# EAGLE schematic untitled (EAGLE 8.1.0)

## Sheet 1 of 2
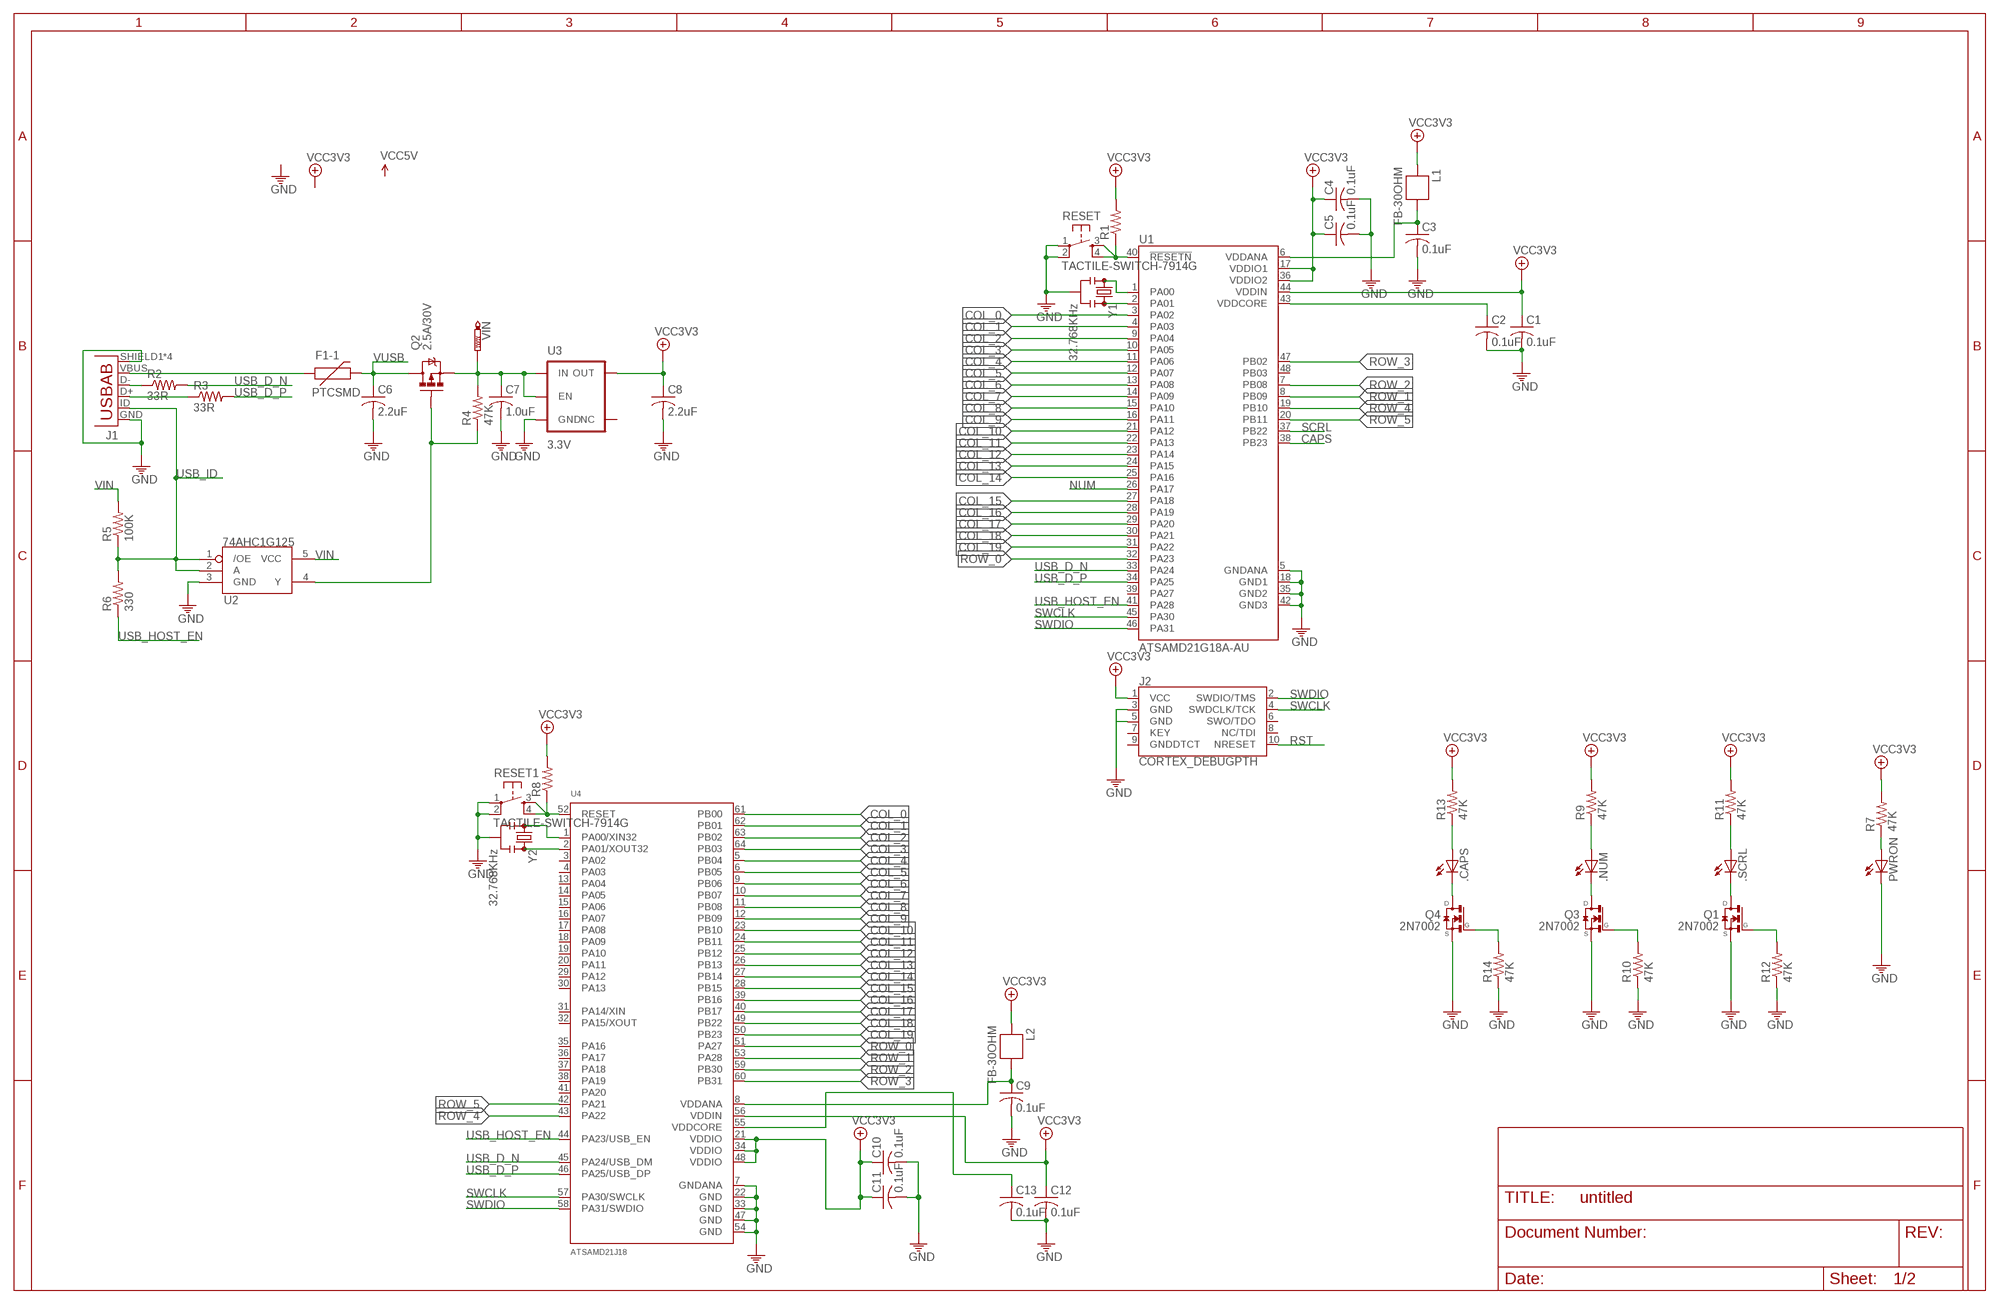
[diagram p0: schematic, sheet 1]

### Parts
.CAPS  LEDCHIPLED_1206  [CHIPLED_1206]
.NUM  LEDCHIPLED_1206  [CHIPLED_1206]
.SCRL  LEDCHIPLED_1206  [CHIPLED_1206]
C1  0.1uF  C-USC0603  [C0603]
C2  0.1uF  C-USC0603  [C0603]
C3  0.1uF  C-USC0603  [C0603]
C4  0.1uF  C-USC0603  [C0603]
C5  0.1uF  C-USC0603  [C0603]
C6  2.2uF  C-USC0603  [C0603]
C7  1.0uF  C-USC0603  [C0603]
C8  2.2uF  C-USC0603  [C0603]
C9  0.1uF  C-USC0603  [C0603]
C10  0.1uF  C-USC0603  [C0603]
C11  0.1uF  C-USC0603  [C0603]
C12  0.1uF  C-USC0603  [C0603]
C13  0.1uF  C-USC0603  [C0603]
F1-1  PTCSMD  [PTC-1206]
J1  USB-AB"  [USB_AB_MICRO_1:1_V2]
J2  CORTEX_DEBUGPTH  [2X5-PTH-1.27MM]
L1  FB-30OHM  FB  [0603]
L2  FB-30OHM  FB  [0603]
PWRON  LEDCHIPLED_1206  [CHIPLED_1206]
Q1  2N7002  [SOT23]
Q2  2.5A/30V  MOSFET-PCHANNELDMG2307L  [SOT23-3]
Q3  2N7002  [SOT23]
Q4  2N7002  [SOT23]
R1  R-US_R0603  [R0603]
R2  33R  R-US_R0603  [R0603]
R3  33R  R-US_R0603  [R0603]
R4  47K  R-US_R0603  [R0603]
R5  100K  R-US_R0603  [R0603]
R6  330  R-US_R0603  [R0603]
R7  47K  R-US_R0603  [R0603]
R8  R-US_R0603  [R0603]
R9  47K  R-US_R0603  [R0603]
R10  47K  R-US_R0603  [R0603]
R11  47K  R-US_R0603  [R0603]
R12  47K  R-US_R0603  [R0603]
R13  47K  R-US_R0603  [R0603]
R14  47K  R-US_R0603  [R0603]
RESET  TACTILE-SWITCH-7914G  [7914G]
RESET1  TACTILE-SWITCH-7914G  [7914G]
U1  ATSAMD21G18A-AU  [QFP50P900X900X120-48N]
U2  74AHC1G125  [SOT23-5]
U3  3.3V  V_REG_AP2112K-3.3V  [SOT23-5]
U4  ATSAMD21J18  [ATSAMD21J18]
VIN  PTR1PAD1-17  [P1-17]
Y1  32.768KHz  RESONATOR16MHZ  [RESONATOR-SMD]
Y2  32.768KHz  RESONATOR16MHZ  [RESONATOR-SMD]

### Nets
CAPS: Q4.1(G) R14.2 U1.38(PB23)
COL_0: U1.3(PA02) U4.61(PB00) ; also sheet 2
COL_1: U1.4(PA03) U4.62(PB01) ; also sheet 2
COL_2: U1.9(PA04) U4.63(PB02) ; also sheet 2
COL_3: U1.10(PA05) U4.64(PB03) ; also sheet 2
COL_4: U1.11(PA06) U4.5(PB04) ; also sheet 2
COL_5: U1.12(PA07) U4.6(PB05) ; also sheet 2
COL_6: U1.13(PA08) U4.9(PB06) ; also sheet 2
COL_7: U1.14(PA09) U4.10(PB07) ; also sheet 2
COL_8: U1.15(PA10) U4.11(PB08) ; also sheet 2
COL_9: U1.16(PA11) U4.12(PB09) ; also sheet 2
COL_10: U1.21(PA12) U4.23(PB10) ; also sheet 2
COL_11: U1.22(PA13) U4.24(PB11) ; also sheet 2
COL_12: U1.23(PA14) U4.25(PB12) ; also sheet 2
COL_13: U1.24(PA15) U4.26(PB13) ; also sheet 2
COL_14: U1.25(PA16) U4.27(PB14) ; also sheet 2
COL_15: U1.27(PA18) U4.28(PB15) ; also sheet 2
COL_16: U1.28(PA19) U4.39(PB16) ; also sheet 2
COL_17: U1.29(PA20) U4.40(PB17) ; also sheet 2
COL_18: U1.30(PA21) U4.49(PB22) ; also sheet 2
COL_19: U1.31(PA22) U4.50(PB23) ; also sheet 2
D_N: J1.D- R2.1
D_P: J1.D+ R3.1
GND: C1.2 C2.2 C3.2 C4.2 C5.2 C6.2 C7.2 C8.2 C9.2 C10.2 C11.2 C12.2 C13.2 J1.GND J1.SHIELD1(SHIELD) J1.SHIELD2(SHIELD) J1.SHIELD3(SHIELD) J1.SHIELD4(SHIELD) J2.3(GND) J2.5(GND) PWRON.C Q1.2(S) Q3.2(S) Q4.2(S) R10.1 R12.1 R14.1 RESET1.1 RESET1.2 RESET.1 RESET.2 U1.5(GNDANA) U1.18(GND1) U1.35(GND2) U1.42(GND3) U2.3(GND) U3.2(GND) U4.7(GNDANA) U4.22(GND) U4.33(GND) U4.47(GND) U4.54(GND) Y1.2 Y2.2
N$1: U1.1(PA00) Y1.1
N$2: C2.1 U1.43(VDDCORE)
N$3: U1.2(PA01) Y1.3
N$4: C3.1 L1.1 U1.6(VDDANA)
N$6: Q2.1(G) R4.1 U2.4(Y)
N$8: F1-1.1 J1.VBUS
N$9: PWRON.A R7.1
N$10: .SCRL.A R11.1
N$11: .NUM.A R9.1
N$12: .NUM.C Q3.3(D)
N$15: .SCRL.C Q1.3(D)
N$20: U4.1(PA00/XIN32) Y2.1
N$21: U4.2(PA01/XOUT32) Y2.3
N$22: C9.1 L2.1 U4.8(VDDANA)
N$23: C13.1 U4.55(VDDCORE)
N$24: .CAPS.A R13.1
N$25: .CAPS.C Q4.3(D)
NUM: Q3.1(G) R10.2 U1.26(PA17)
ROW_0: U1.32(PA23) U4.51(PA27) ; also sheet 2
ROW_1: U1.8(PB09) U4.53(PA28) ; also sheet 2
ROW_2: U1.7(PB08) U4.59(PB30) ; also sheet 2
ROW_3: U1.47(PB02) U4.60(PB31) ; also sheet 2
ROW_4: U1.19(PB10) U4.43(PA22) ; also sheet 2
ROW_5: U1.20(PB11) U4.42(PA21) ; also sheet 2
RST: J2.10(NRESET) R1.1 RESET.3 RESET.4 U1.40(!RESETN)
RST1: R8.1 RESET1.3 RESET1.4 U4.52(RESET)
SCRL: Q1.1(G) R12.2 U1.37(PB22)
SWCLK: J2.4(SWDCLK/TCK) U1.45(PA30) U4.57(PA30/SWCLK)
SWDIO: J2.2(SWDIO/TMS) U1.46(PA31) U4.58(PA31/SWDIO)
USB_D_N: R2.2 U1.33(PA24) U4.45(PA24/USB_DM)
USB_D_P: R3.2 U1.34(PA25) U4.46(PA25/USB_DP)
USB_HOST_EN: R6.1 U1.41(PA28)
USB_ID: J1.ID(USBID) R5.1 R6.2 U2.1(/OE) U2.2(A)
VCC3V3: C1.1 C4.1 C5.1 C8.1 C10.1 C11.1 C12.1 J2.1(VCC) L1.2 L2.2 R1.2 R7.2 R8.2 R9.2 R11.2 R13.2 U1.17(VDDIO1) U1.36(VDDIO2) U1.44(VDDIN) U3.5(OUT) U4.21(VDDIO) U4.34(VDDIO) U4.48(VDDIO) U4.56(VDDIN)
VIN: C7.1 Q2.2(S) R4.2 R5.2 U2.5(VCC) U3.1(IN) U3.3(EN) VIN.TP
VUSB: C6.1 F1-1.2 Q2.3(D)
Unconnected: J2.6(SWO/TDO) J2.7(KEY) J2.8(NC/TDI) J2.9(GNDDTCT) U1.39(PA27) U1.48(PB03) U3.4(NC) U4.3(PA02) U4.4(PA03) U4.13(PA04) U4.14(PA05) U4.15(PA06) U4.16(PA07) U4.17(PA08) U4.18(PA09) U4.19(PA10) U4.20(PA11) U4.29(PA12) U4.30(PA13) U4.31(PA14/XIN) U4.32(PA15/XOUT) U4.35(PA16) U4.36(PA17) U4.37(PA18) U4.38(PA19) U4.41(PA20) U4.44(PA23/USB_EN)

## Sheet 2 of 2
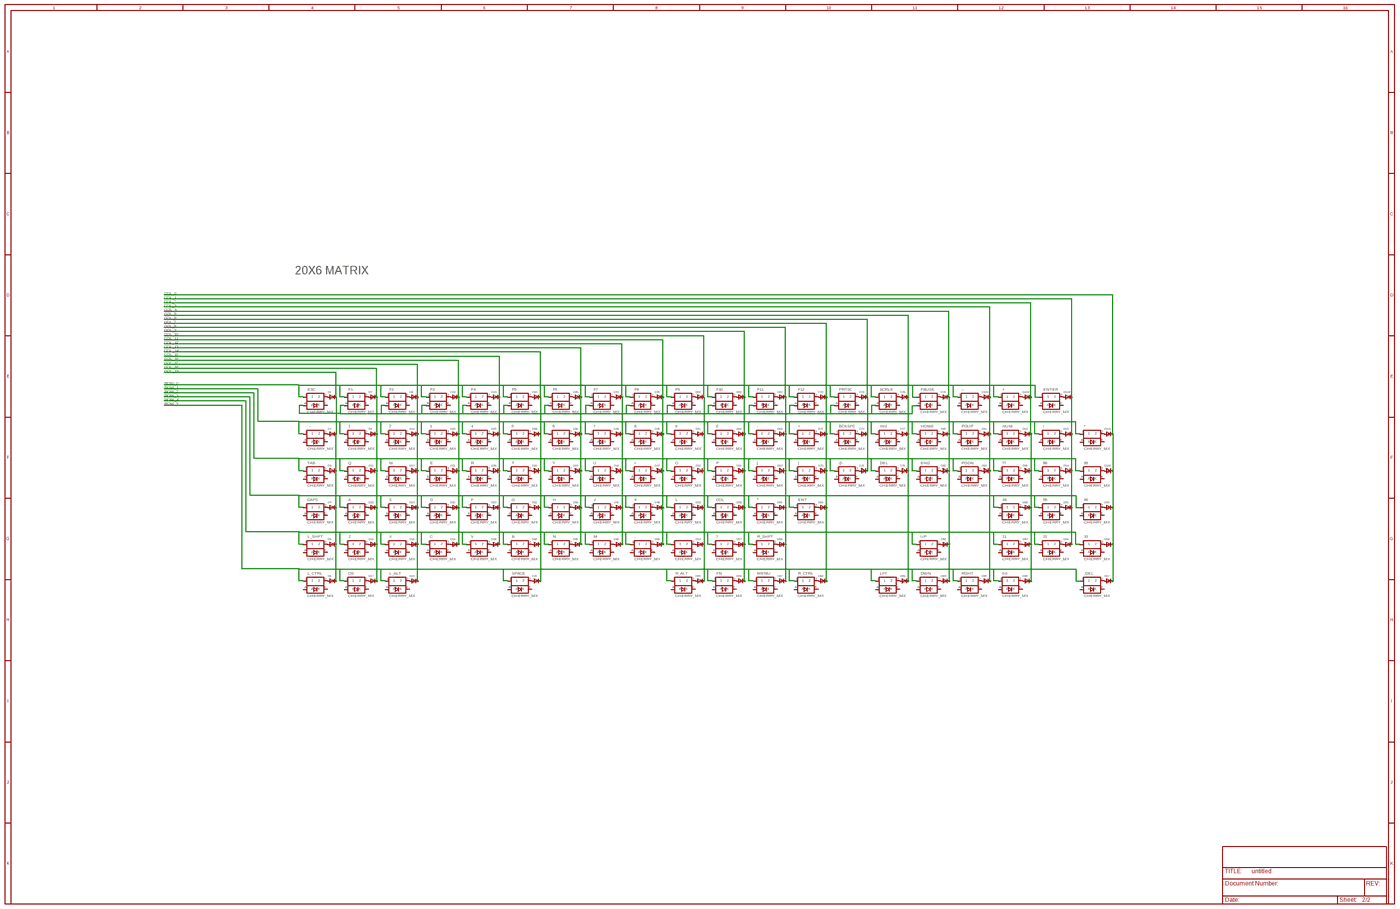
[diagram p1: schematic, sheet 2, overview]
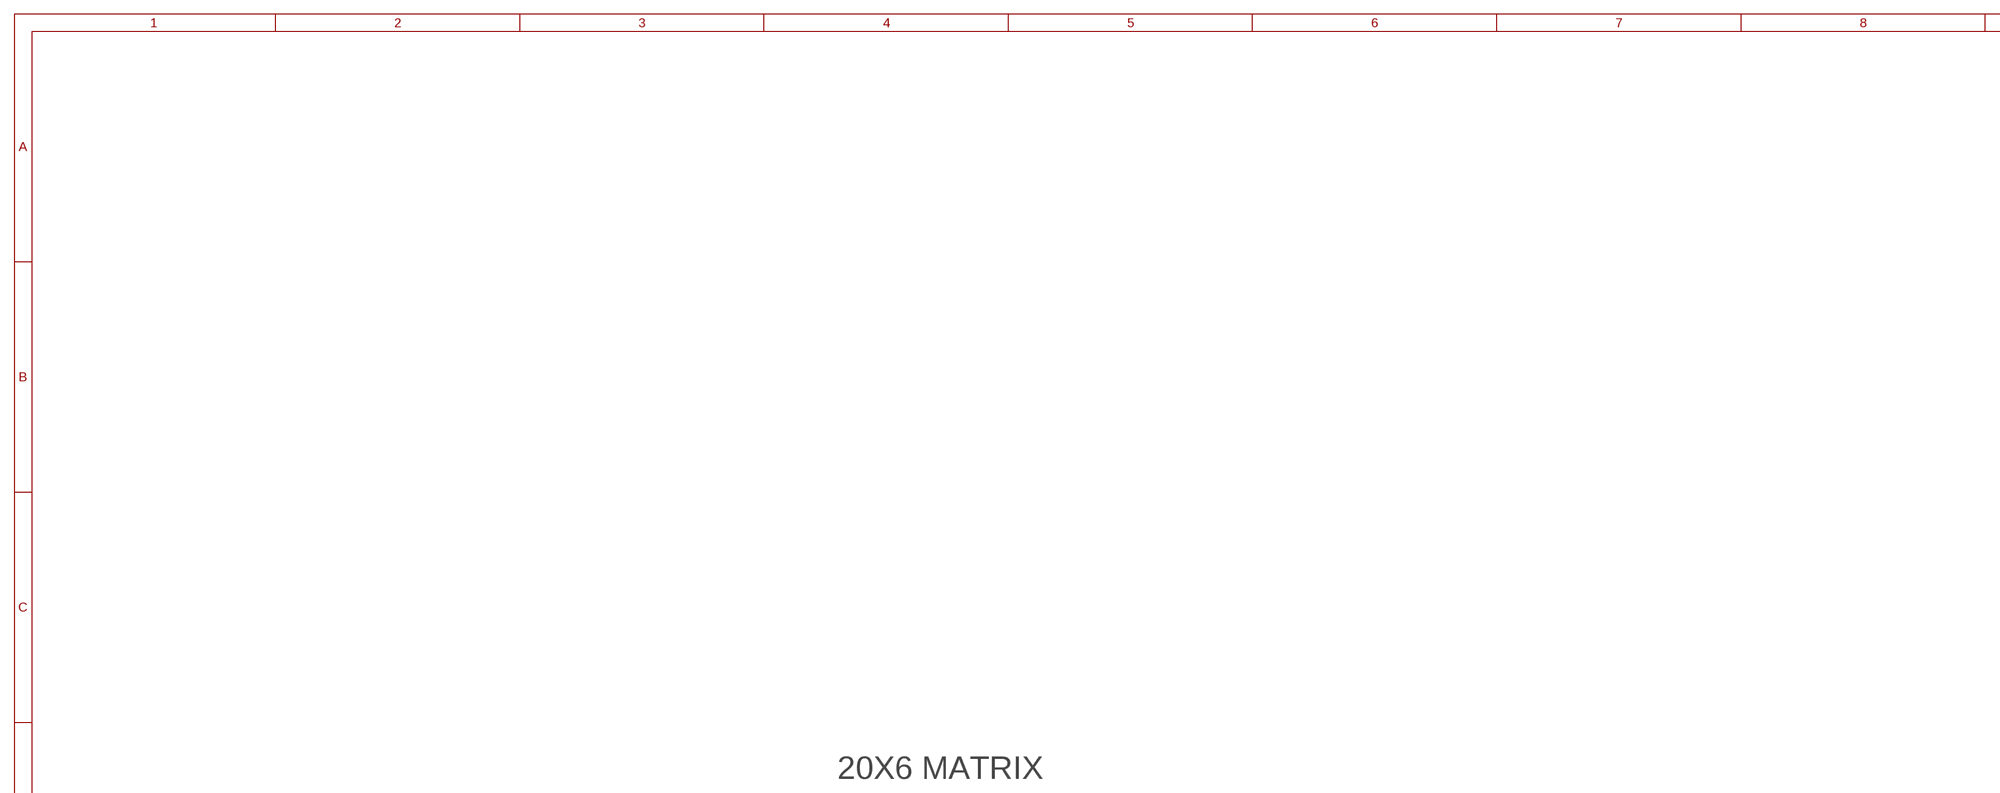
[diagram p2: schematic, sheet 2, part 1 of 4]
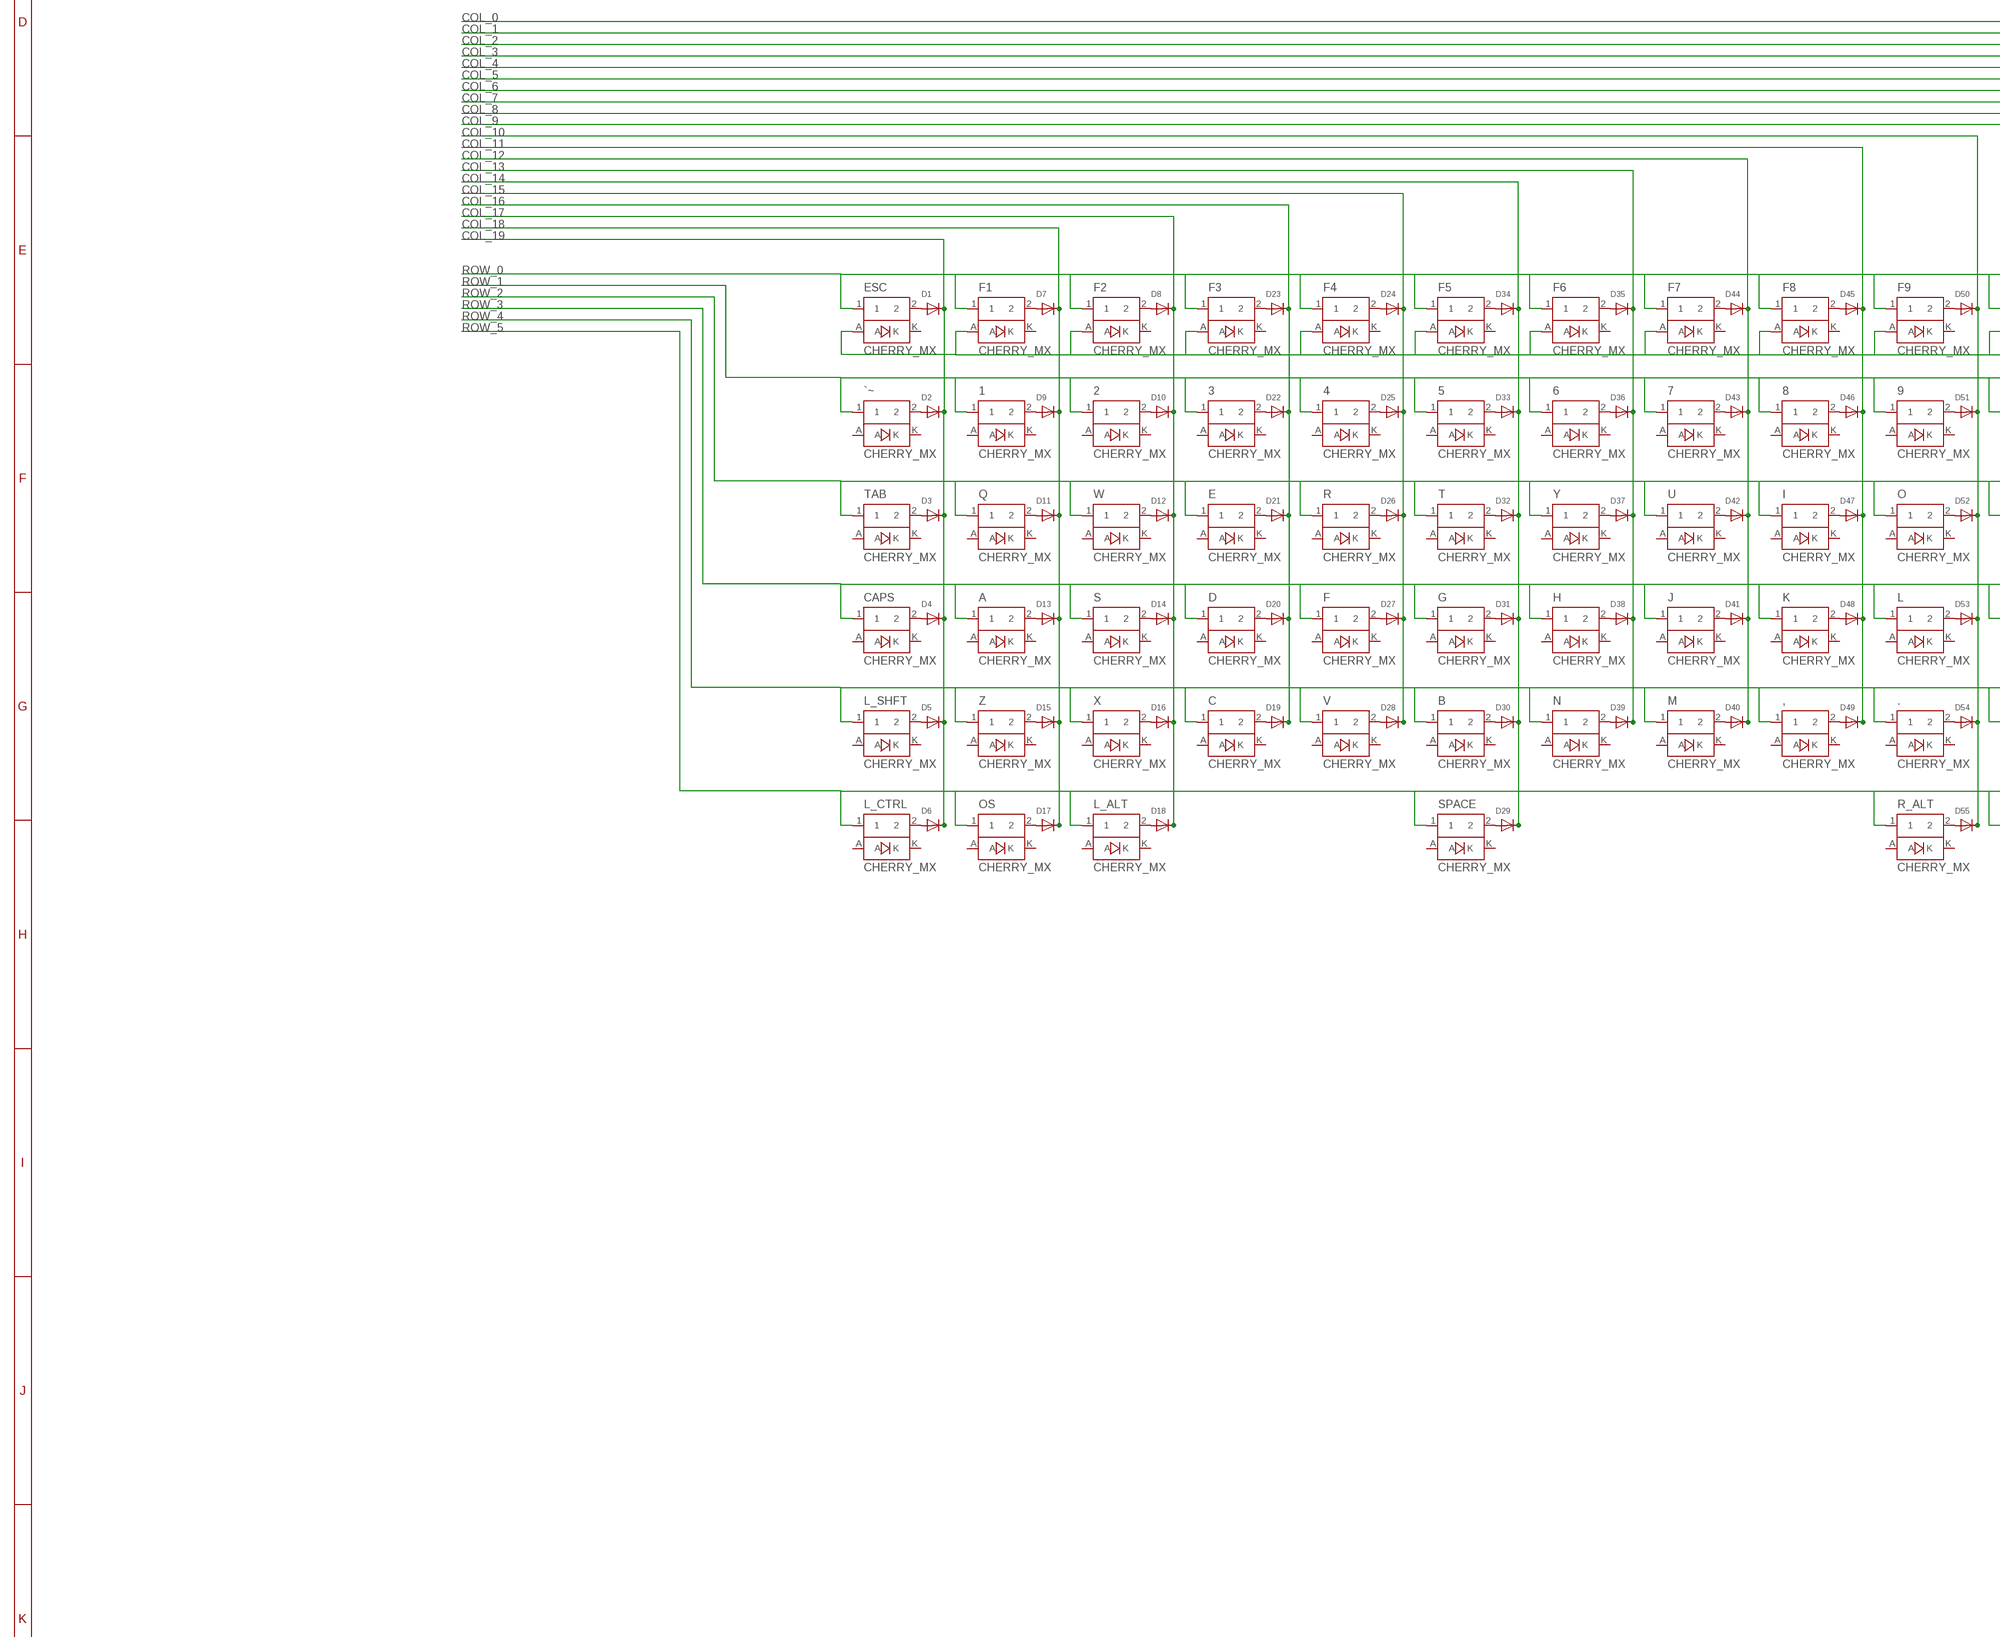
[diagram p3: schematic, sheet 2, part 2 of 4]
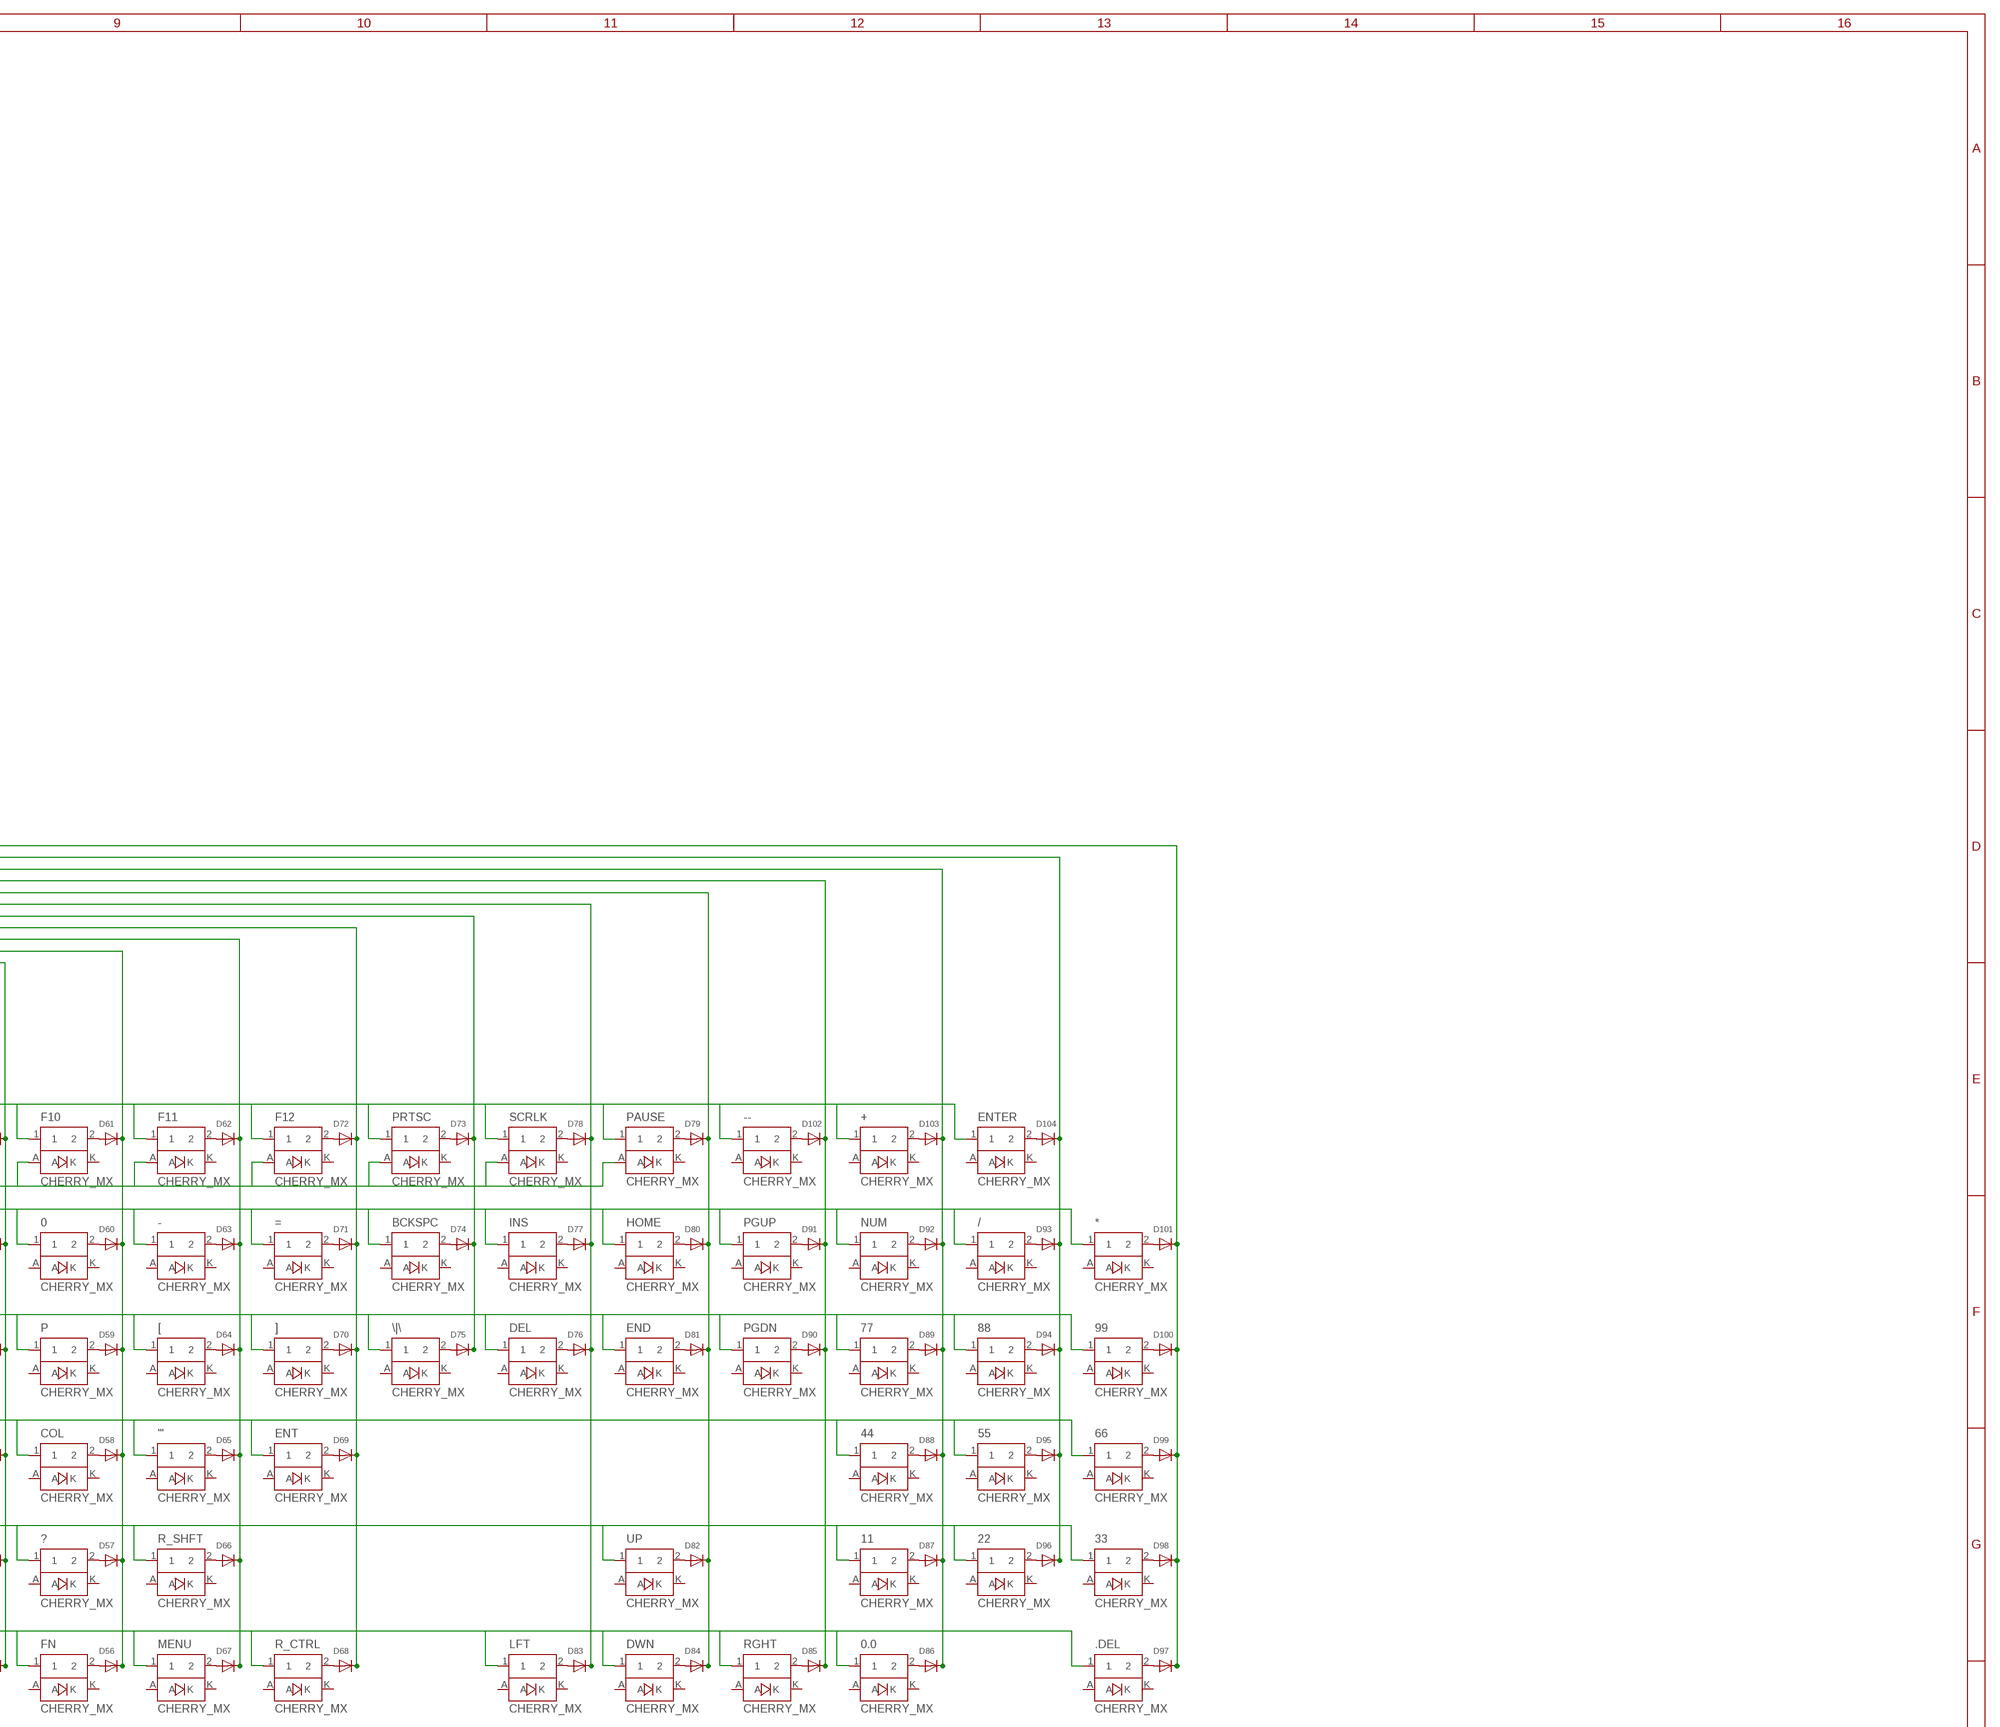
[diagram p4: schematic, sheet 2, part 3 of 4]
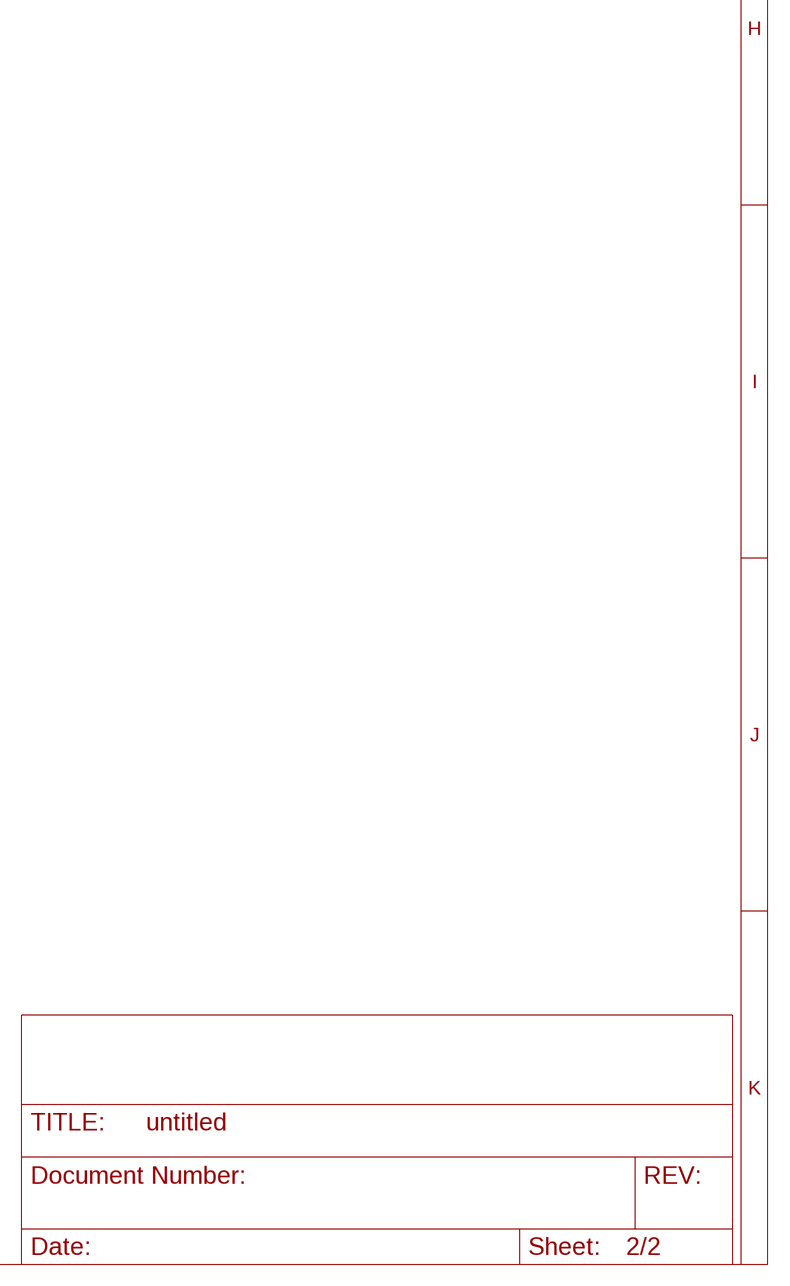
[diagram p5: schematic, sheet 2, part 4 of 4]

### Parts
0  CHERRY_MX  [CHERRY_MX]
0.0  CHERRY_MX  [CHERRY_MX]
1  CHERRY_MX  [CHERRY_MX]
2  CHERRY_MX  [CHERRY_MX]
3  CHERRY_MX  [CHERRY_MX]
4  CHERRY_MX  [CHERRY_MX]
5  CHERRY_MX  [CHERRY_MX]
6  CHERRY_MX  [CHERRY_MX]
7  CHERRY_MX  [CHERRY_MX]
8  CHERRY_MX  [CHERRY_MX]
9  CHERRY_MX  [CHERRY_MX]
11  CHERRY_MX  [CHERRY_MX]
22  CHERRY_MX  [CHERRY_MX]
33  CHERRY_MX  [CHERRY_MX]
44  CHERRY_MX  [CHERRY_MX]
55  CHERRY_MX  [CHERRY_MX]
66  CHERRY_MX  [CHERRY_MX]
77  CHERRY_MX  [CHERRY_MX]
88  CHERRY_MX  [CHERRY_MX]
99  CHERRY_MX  [CHERRY_MX]
'"  CHERRY_MX  [CHERRY_MX]
*  CHERRY_MX  [CHERRY_MX]
+  CHERRY_MX  [CHERRY_MX]
,  CHERRY_MX  [CHERRY_MX]
-  CHERRY_MX  [CHERRY_MX]
--  CHERRY_MX  [CHERRY_MX]
.  CHERRY_MX  [CHERRY_MX]
.DEL  CHERRY_MX  [CHERRY_MX]
/  CHERRY_MX  [CHERRY_MX]
=  CHERRY_MX  [CHERRY_MX]
?  CHERRY_MX  [CHERRY_MX]
[  CHERRY_MX  [CHERRY_MX]
\|\  CHERRY_MX  [CHERRY_MX]
]  CHERRY_MX  [CHERRY_MX]
`~  CHERRY_MX  [CHERRY_MX]
A  CHERRY_MX  [CHERRY_MX]
B  CHERRY_MX  [CHERRY_MX]
BCKSPC  CHERRY_MX  [CHERRY_MX]
C  CHERRY_MX  [CHERRY_MX]
CAPS  CHERRY_MX  [CHERRY_MX]
COL  CHERRY_MX  [CHERRY_MX]
D  CHERRY_MX  [CHERRY_MX]
D1  DIODESOD-323F  [SOD-323F]
D2  DIODESOD-323F  [SOD-323F]
D3  DIODESOD-323F  [SOD-323F]
D4  DIODESOD-323F  [SOD-323F]
D5  DIODESOD-323F  [SOD-323F]
D6  DIODESOD-323F  [SOD-323F]
D7  DIODESOD-323F  [SOD-323F]
D8  DIODESOD-323F  [SOD-323F]
D9  DIODESOD-323F  [SOD-323F]
D10  DIODESOD-323F  [SOD-323F]
D11  DIODESOD-323F  [SOD-323F]
D12  DIODESOD-323F  [SOD-323F]
D13  DIODESOD-323F  [SOD-323F]
D14  DIODESOD-323F  [SOD-323F]
D15  DIODESOD-323F  [SOD-323F]
D16  DIODESOD-323F  [SOD-323F]
D17  DIODESOD-323F  [SOD-323F]
D18  DIODESOD-323F  [SOD-323F]
D19  DIODESOD-323F  [SOD-323F]
D20  DIODESOD-323F  [SOD-323F]
D21  DIODESOD-323F  [SOD-323F]
D22  DIODESOD-323F  [SOD-323F]
D23  DIODESOD-323F  [SOD-323F]
D24  DIODESOD-323F  [SOD-323F]
D25  DIODESOD-323F  [SOD-323F]
D26  DIODESOD-323F  [SOD-323F]
D27  DIODESOD-323F  [SOD-323F]
D28  DIODESOD-323F  [SOD-323F]
D29  DIODESOD-323F  [SOD-323F]
D30  DIODESOD-323F  [SOD-323F]
D31  DIODESOD-323F  [SOD-323F]
D32  DIODESOD-323F  [SOD-323F]
D33  DIODESOD-323F  [SOD-323F]
D34  DIODESOD-323F  [SOD-323F]
D35  DIODESOD-323F  [SOD-323F]
D36  DIODESOD-323F  [SOD-323F]
D37  DIODESOD-323F  [SOD-323F]
D38  DIODESOD-323F  [SOD-323F]
D39  DIODESOD-323F  [SOD-323F]
D40  DIODESOD-323F  [SOD-323F]
D41  DIODESOD-323F  [SOD-323F]
D42  DIODESOD-323F  [SOD-323F]
D43  DIODESOD-323F  [SOD-323F]
D44  DIODESOD-323F  [SOD-323F]
D45  DIODESOD-323F  [SOD-323F]
D46  DIODESOD-323F  [SOD-323F]
D47  DIODESOD-323F  [SOD-323F]
D48  DIODESOD-323F  [SOD-323F]
D49  DIODESOD-323F  [SOD-323F]
D50  DIODESOD-323F  [SOD-323F]
D51  DIODESOD-323F  [SOD-323F]
D52  DIODESOD-323F  [SOD-323F]
D53  DIODESOD-323F  [SOD-323F]
D54  DIODESOD-323F  [SOD-323F]
D55  DIODESOD-323F  [SOD-323F]
D56  DIODESOD-323F  [SOD-323F]
D57  DIODESOD-323F  [SOD-323F]
D58  DIODESOD-323F  [SOD-323F]
D59  DIODESOD-323F  [SOD-323F]
D60  DIODESOD-323F  [SOD-323F]
D61  DIODESOD-323F  [SOD-323F]
D62  DIODESOD-323F  [SOD-323F]
D63  DIODESOD-323F  [SOD-323F]
D64  DIODESOD-323F  [SOD-323F]
D65  DIODESOD-323F  [SOD-323F]
D66  DIODESOD-323F  [SOD-323F]
D67  DIODESOD-323F  [SOD-323F]
D68  DIODESOD-323F  [SOD-323F]
D69  DIODESOD-323F  [SOD-323F]
D70  DIODESOD-323F  [SOD-323F]
D71  DIODESOD-323F  [SOD-323F]
D72  DIODESOD-323F  [SOD-323F]
D73  DIODESOD-323F  [SOD-323F]
D74  DIODESOD-323F  [SOD-323F]
D75  DIODESOD-323F  [SOD-323F]
D76  DIODESOD-323F  [SOD-323F]
D77  DIODESOD-323F  [SOD-323F]
D78  DIODESOD-323F  [SOD-323F]
D79  DIODESOD-323F  [SOD-323F]
D80  DIODESOD-323F  [SOD-323F]
D81  DIODESOD-323F  [SOD-323F]
D82  DIODESOD-323F  [SOD-323F]
D83  DIODESOD-323F  [SOD-323F]
D84  DIODESOD-323F  [SOD-323F]
D85  DIODESOD-323F  [SOD-323F]
D86  DIODESOD-323F  [SOD-323F]
D87  DIODESOD-323F  [SOD-323F]
D88  DIODESOD-323F  [SOD-323F]
D89  DIODESOD-323F  [SOD-323F]
D90  DIODESOD-323F  [SOD-323F]
D91  DIODESOD-323F  [SOD-323F]
D92  DIODESOD-323F  [SOD-323F]
D93  DIODESOD-323F  [SOD-323F]
D94  DIODESOD-323F  [SOD-323F]
D95  DIODESOD-323F  [SOD-323F]
D96  DIODESOD-323F  [SOD-323F]
D97  DIODESOD-323F  [SOD-323F]
D98  DIODESOD-323F  [SOD-323F]
D99  DIODESOD-323F  [SOD-323F]
D100  DIODESOD-323F  [SOD-323F]
D101  DIODESOD-323F  [SOD-323F]
D102  DIODESOD-323F  [SOD-323F]
D103  DIODESOD-323F  [SOD-323F]
D104  DIODESOD-323F  [SOD-323F]
DEL  CHERRY_MX  [CHERRY_MX]
DWN  CHERRY_MX  [CHERRY_MX]
E  CHERRY_MX  [CHERRY_MX]
END  CHERRY_MX  [CHERRY_MX]
ENT  CHERRY_MX  [CHERRY_MX]
ENTER  CHERRY_MX  [CHERRY_MX]
ESC  CHERRY_MX  [CHERRY_MX]
F  CHERRY_MX  [CHERRY_MX]
F1  CHERRY_MX  [CHERRY_MX]
F2  CHERRY_MX  [CHERRY_MX]
F3  CHERRY_MX  [CHERRY_MX]
F4  CHERRY_MX  [CHERRY_MX]
F5  CHERRY_MX  [CHERRY_MX]
F6  CHERRY_MX  [CHERRY_MX]
F7  CHERRY_MX  [CHERRY_MX]
F8  CHERRY_MX  [CHERRY_MX]
F9  CHERRY_MX  [CHERRY_MX]
F10  CHERRY_MX  [CHERRY_MX]
F11  CHERRY_MX  [CHERRY_MX]
F12  CHERRY_MX  [CHERRY_MX]
FN  CHERRY_MX  [CHERRY_MX]
G  CHERRY_MX  [CHERRY_MX]
H  CHERRY_MX  [CHERRY_MX]
HOME  CHERRY_MX  [CHERRY_MX]
I  CHERRY_MX  [CHERRY_MX]
INS  CHERRY_MX  [CHERRY_MX]
J  CHERRY_MX  [CHERRY_MX]
K  CHERRY_MX  [CHERRY_MX]
L  CHERRY_MX  [CHERRY_MX]
L_ALT  CHERRY_MX  [CHERRY_MX]
L_CTRL  CHERRY_MX  [CHERRY_MX]
L_SHFT  CHERRY_MX  [CHERRY_MX]
LFT  CHERRY_MX  [CHERRY_MX]
M  CHERRY_MX  [CHERRY_MX]
MENU  CHERRY_MX  [CHERRY_MX]
N  CHERRY_MX  [CHERRY_MX]
NUM  CHERRY_MX  [CHERRY_MX]
O  CHERRY_MX  [CHERRY_MX]
OS  CHERRY_MX  [CHERRY_MX]
P  CHERRY_MX  [CHERRY_MX]
PAUSE  CHERRY_MX  [CHERRY_MX]
PGDN  CHERRY_MX  [CHERRY_MX]
PGUP  CHERRY_MX  [CHERRY_MX]
PRTSC  CHERRY_MX  [CHERRY_MX]
Q  CHERRY_MX  [CHERRY_MX]
R  CHERRY_MX  [CHERRY_MX]
R_ALT  CHERRY_MX  [CHERRY_MX]
R_CTRL  CHERRY_MX  [CHERRY_MX]
R_SHFT  CHERRY_MX  [CHERRY_MX]
RGHT  CHERRY_MX  [CHERRY_MX]
S  CHERRY_MX  [CHERRY_MX]
SCRLK  CHERRY_MX  [CHERRY_MX]
SPACE  CHERRY_MX  [CHERRY_MX]
T  CHERRY_MX  [CHERRY_MX]
TAB  CHERRY_MX  [CHERRY_MX]
U  CHERRY_MX  [CHERRY_MX]
UP  CHERRY_MX  [CHERRY_MX]
V  CHERRY_MX  [CHERRY_MX]
W  CHERRY_MX  [CHERRY_MX]
X  CHERRY_MX  [CHERRY_MX]
Y  CHERRY_MX  [CHERRY_MX]
Z  CHERRY_MX  [CHERRY_MX]

### Nets
COL_0: D97.C D98.C D99.C D100.C D101.C ; also sheet 1
COL_1: D93.C D94.C D95.C D96.C D104.C ; also sheet 1
COL_2: D86.C D87.C D88.C D89.C D92.C D103.C ; also sheet 1
COL_3: D85.C D90.C D91.C D102.C ; also sheet 1
COL_4: D79.C D80.C D81.C D82.C D84.C ; also sheet 1
COL_5: D76.C D77.C D78.C D83.C ; also sheet 1
COL_6: D73.C D74.C D75.C ; also sheet 1
COL_7: D68.C D69.C D70.C D71.C D72.C ; also sheet 1
COL_8: D62.C D63.C D64.C D65.C D66.C D67.C ; also sheet 1
COL_9: D56.C D57.C D58.C D59.C D60.C D61.C ; also sheet 1
COL_10: D50.C D51.C D52.C D53.C D54.C D55.C ; also sheet 1
COL_11: D45.C D46.C D47.C D48.C D49.C ; also sheet 1
COL_12: D40.C D41.C D42.C D43.C D44.C ; also sheet 1
COL_13: D35.C D36.C D37.C D38.C D39.C ; also sheet 1
COL_14: D29.C D30.C D31.C D32.C D33.C D34.C ; also sheet 1
COL_15: D24.C D25.C D26.C D27.C D28.C ; also sheet 1
COL_16: D19.C D20.C D21.C D22.C D23.C ; also sheet 1
COL_17: D8.C D10.C D12.C D14.C D16.C D18.C ; also sheet 1
COL_18: D7.C D9.C D11.C D13.C D15.C D17.C ; also sheet 1
COL_19: D1.C D2.C D3.C D4.C D5.C D6.C ; also sheet 1
N$33: D1.A ESC.2
N$34: ESC.A F1.A F2.A F3.A F4.A F5.A F6.A F7.A F8.A F9.A F10.A F11.A F12.A PAUSE.A PRTSC.A SCRLK.A
N$35: D7.A F1.2
N$36: `~.2 D2.A
N$37: D3.A TAB.2
N$38: CAPS.2 D4.A
N$39: D5.A L_SHFT.2
N$40: D6.A L_CTRL.2
N$42: D8.A F2.2
N$43: 1.2 D9.A
N$44: 2.2 D10.A
N$45: D11.A Q.2
N$46: D12.A W.2
N$47: A.2 D13.A
N$48: D14.A S.2
N$49: D15.A Z.2
N$50: D16.A X.2
N$51: D17.A OS.2
N$52: D18.A L_ALT.2
N$53: C.2 D19.A
N$54: D20.A D.2
N$55: D21.A E.2
N$56: 3.2 D22.A
N$57: D23.A F3.2
N$58: D24.A F4.2
N$59: 4.2 D25.A
N$60: D26.A R.2
N$61: D27.A F.2
N$62: D28.A V.2
N$63: D29.A SPACE.2
N$64: B.2 D30.A
N$65: D31.A G.2
N$66: D32.A T.2
N$67: 5.2 D33.A
N$68: D34.A F5.2
N$69: D35.A F6.2
N$70: 6.2 D36.A
N$71: D37.A Y.2
N$72: D38.A H.2
N$73: D39.A N.2
N$74: D40.A M.2
N$75: D41.A J.2
N$76: D42.A U.2
N$77: 7.2 D43.A
N$78: D44.A F7.2
N$79: D45.A F8.2
N$80: 8.2 D46.A
N$81: D47.A I.2
N$82: D48.A K.2
N$83: ,.2 D49.A
N$84: D50.A F9.2
N$85: 9.2 D51.A
N$86: D52.A O.2
N$87: D53.A L.2
N$88: ..2 D54.A
N$89: D55.A R_ALT.2
N$90: D56.A FN.2
N$91: ?.2 D57.A
N$92: COL.2 D58.A
N$93: D59.A P.2
N$94: 0.2 D60.A
N$95: D61.A F10.2
N$96: D62.A F11.2
N$97: -.2 D63.A
N$98: [.2 D64.A
N$99: '".2 D65.A
N$100: D66.A R_SHFT.2
N$101: D67.A MENU.2
N$102: D68.A R_CTRL.2
N$103: D69.A ENT.2
N$104: ].2 D70.A
N$105: =.2 D71.A
N$106: D72.A F12.2
N$107: D73.A PRTSC.2
N$108: BCKSPC.2 D74.A
N$109: \|\.2 D75.A
N$110: D76.A DEL.2
N$111: D77.A INS.2
N$112: D78.A SCRLK.2
N$113: D79.A PAUSE.2
N$114: D80.A HOME.2
N$115: D81.A END.2
N$116: D82.A UP.2
N$117: D83.A LFT.2
N$118: D84.A DWN.2
N$119: D85.A RGHT.2
N$120: 0.0.2 D86.A
N$121: 11.2 D87.A
N$122: 44.2 D88.A
N$123: 77.2 D89.A
N$124: D90.A PGDN.2
N$125: D91.A PGUP.2
N$126: D92.A NUM.2
N$127: /.2 D93.A
N$128: 88.2 D94.A
N$129: 55.2 D95.A
N$130: 22.2 D96.A
N$131: .DEL.2 D97.A
N$132: 33.2 D98.A
N$133: 66.2 D99.A
N$134: 99.2 D100.A
N$135: *.2 D101.A
N$136: --.2 D102.A
N$137: D104.A ENTER.2
N$158: +.2 D103.A
ROW_0: +.1 --.1 ENTER.1 ESC.1 F1.1 F2.1 F3.1 F4.1 F5.1 F6.1 F7.1 F8.1 F9.1 F10.1 F11.1 F12.1 PAUSE.1 PRTSC.1 SCRLK.1 ; also sheet 1
ROW_1: 0.1 1.1 2.1 3.1 4.1 5.1 6.1 7.1 8.1 9.1 *.1 -.1 /.1 =.1 `~.1 BCKSPC.1 HOME.1 INS.1 NUM.1 PGUP.1 ; also sheet 1
ROW_2: 77.1 88.1 99.1 [.1 \|\.1 ].1 DEL.1 E.1 END.1 I.1 O.1 P.1 PGDN.1 Q.1 R.1 T.1 TAB.1 U.1 W.1 Y.1 ; also sheet 1
ROW_3: 44.1 55.1 66.1 '".1 A.1 CAPS.1 COL.1 D.1 ENT.1 F.1 G.1 H.1 J.1 K.1 L.1 S.1 ; also sheet 1
ROW_4: 11.1 22.1 33.1 ,.1 ..1 ?.1 B.1 C.1 L_SHFT.1 M.1 N.1 R_SHFT.1 UP.1 V.1 X.1 Z.1 ; also sheet 1
ROW_5: 0.0.1 .DEL.1 DWN.1 FN.1 L_ALT.1 L_CTRL.1 LFT.1 MENU.1 OS.1 R_ALT.1 R_CTRL.1 RGHT.1 SPACE.1 ; also sheet 1
Unconnected: 0.0.A 0.0.K 0.A 0.K 1.A 1.K 2.A 2.K 3.A 3.K 4.A 4.K 5.A 5.K 6.A 6.K 7.A 7.K 8.A 8.K 9.A 9.K 11.A 11.K 22.A 22.K 33.A 33.K 44.A 44.K 55.A 55.K 66.A 66.K 77.A 77.K 88.A 88.K 99.A 99.K '".A '".K *.A *.K +.A +.K ,.A ,.K --.A --.K -.A -.K ..A ..K .DEL.A .DEL.K /.A /.K =.A =.K ?.A ?.K [.A [.K \|\.A \|\.K ].A ].K `~.A `~.K A.A A.K B.A B.K BCKSPC.A BCKSPC.K C.A C.K CAPS.A CAPS.K COL.A COL.K D.A D.K DEL.A DEL.K DWN.A DWN.K E.A E.K END.A END.K ENT.A ENT.K ENTER.A ENTER.K ESC.K F1.K F2.K F3.K F4.K F5.K F6.K F7.K F8.K F9.K F10.K F11.K F12.K F.A F.K FN.A FN.K G.A G.K H.A H.K HOME.A HOME.K I.A I.K INS.A INS.K J.A J.K K.A K.K L.A L.K L_ALT.A L_ALT.K L_CTRL.A L_CTRL.K L_SHFT.A L_SHFT.K LFT.A LFT.K M.A M.K MENU.A MENU.K N.A N.K NUM.A NUM.K O.A O.K OS.A OS.K P.A P.K PAUSE.K PGDN.A PGDN.K PGUP.A PGUP.K PRTSC.K Q.A Q.K R.A R.K R_ALT.A R_ALT.K R_CTRL.A R_CTRL.K R_SHFT.A R_SHFT.K RGHT.A RGHT.K S.A S.K SCRLK.K SPACE.A SPACE.K T.A T.K TAB.A TAB.K U.A U.K UP.A UP.K V.A V.K W.A W.K X.A X.K Y.A Y.K Z.A Z.K

### Notes on the sheet
- 20X6 MATRIX

## Library data of the parts
0 0.0 1-9 11 22 33 44 55 66 77 88 99 '" * + , - -- . .DEL / = ? [ \|\ ] `~ A B BCKSPC C CAPS COL D DEL DWN E END ENT ENTER ESC F F1-F12 FN G H HOME I INS J K L L_ALT L_CTRL L_SHFT LFT M MENU N NUM O OS P PAUSE PGDN PGUP PRTSC Q R R_ALT R_CTRL R_SHFT RGHT S SCRLK SPACE T TAB U UP V W X Y Z = ALLEYBEACH_LIB:CHERRY_MX
.CAPS .NUM .SCRL PWRON = adafruit:LED: LED OSRAM: - CHIPLED LG R971, LG N971, LY N971, LG Q971, LY Q971, LO R971, LY R971 LH N974, LH R974 LS Q976, LO Q976, LY Q976 LO Q996 - Hyper CHIPLED LW Q18S LB Q993, LB Q99A, LB R99A - SideLED LS A670, LO A670, LY A670, LG A670, LP A670 LB A673, LV A673, LT A673, LW A673 LH A674 LY A675 LS A676, LA A676, LO A676, LY A676, LW A676 LS A679, LY A679, LG A679 - Hyper Micro SIDELED® LS Y876, LA Y876, LO Y876, LY Y876 LT Y87S - SmartLED LW L88C, LW L88S LB L89C, LB L89S, LG L890 LS L89K, LO L89K, LY L89K LS L896, LA L896, LO L896, LY L896 - TOPLED LS T670, LO T670, LY T670, LG T670, LP T670 LSG T670, LSP T670, LSY T670, LOP T670, LYG T670 LG T671, LOG T671, LSG T671 LB T673, LV T673, LT T673, LW T673 LH T674 LS T676, LA T676, LO T676, LY T676, LB T676, LH T676, LSB T676, LW T676 LB T67C, LV T67C, LT T67C, LS T67K, LO T67K, LY T67K, LW E67C LS E67B, LA E67B, LO E67B, LY E67B, LB E67C, LV E67C, LT E67C LW T67C LS T679, LY T679, LG T679 LS T770, LO T770, LY T770, LG T770, LP T770 LB T773, LV T773, LT T773, LW T773 LH T774 LS E675, LA E675, LY E675, LS T675 LS T776, LA T776, LO T776, LY T776, LB T776 LHGB T686 LT T68C, LB T68C - Hyper Mini TOPLED® LB M676 - Mini TOPLED Santana® LG M470 LS M47K, LO M47K, LY M47K Source: http://www.osram.convergy.de/
C1-C13 = resistor:C-US: CAPACITOR, American symbol
D1-D104 = adafruit:DIODE: Diode SMADIODE - SMA Surface Mount Package 20V 1A Schottky Diode Digikey: 641-1014-6-ND DO-1N4148 - Through Hole Small Current Diode SOD-123 20V 1 A (.5mV Vf) Schottky Diode - Digikey: MBRX120TPMSCT-ND SOD-323 10V 570mA (.38mV Vf, 3ns) Schottky Diode - Digikey: ZLLS410CT-ND SOD-523 30V 30mA Schottky Diode (RB751S-40TE61) - Digikey: RB751S-40TE61CT-ND SOT23-R/W - SOT23 Package (R = Solder Paste/Reflow Ovens, W = Hand-Soldering) BAT54Film 40V 300mA - Digikey: 497-7162-1-ND
F1-1 = SparkFun-PowerIC:PTC: Resettable Fuse PTC Resettable Fuse. Spark Fun Electronics SKU : COM-08357; PROD_ID: RES-11150
J1 = SparkFun-Connectors:USB-AB: This is a USB AB connector that is compatible with USB OTG. i.e. this connector can serve as a host or device
J2 = SparkFun-Connectors:CORTEX_DEBUG: Cortex Debug Connector Datasheet <http://infocenter.arm.com/help/topic/com.arm.doc.faqs/attached/13634/cortex_debug_connectors.pdf>
L1 L2 = SparkFun-Passives:FB
Q1 Q3 Q4 = transistor-fet:2N7002*: N-Channel MOSFET
Q2 = SparkFun-DiscreteSemi:MOSFET-PCHANNEL: Generic PMOSFET IRLML2244 - TRANS-11153 (SOT-23 -20V -4.3A) (1.Gate 2.Source 3.Drain) FQP27P06 - COM-10349 <http://www.sparkfun.com/products/10349> (TO-220 -60V -27A) (1.Gate 2.Source 3.Drain); PROD_ID: TRANS-11308
R1-R14 = resistor:R-US_: RESISTOR, American symbol
RESET RESET1 = GeekAmmo:TACTILE-SWITCH: Tactile Switch 4 Pins, SPST NO
U1 = ATSAMD21G18A-AU:ATSAMD21G18A-AU: Cortex-M0+, 256KB FLASH, 32KB SRAM, USB, DMA, T&R - 48TQFP IND TEMP, GREEN, 1.6-3.6V, 48MHz; AVAILABILITY: Good; DESCRIPTION: Cortex-M0+, 256KB FLASH, 32KB SRAM, USB, DMA, T&amp;R - 48TQFP IND TEMP, GREEN, 1.6-3.6V, 48MHz; MF: Atmel; MP: ATSAMD21G18A-AU; PACKAGE: TQFP-48 Atmel; PRICE: 3.04 USD
U2 = SparkFun-DigitalIC:74AHC1G125: Single bus buffer gate with 3-state output; PROD_ID: IC-11920
U3 = SparkFun-PowerIC:V_REG_AP2112: AP2112 - 600mA CMOS LDO Regulator w/ Enable The AP2112 is CMOS process low dropout linear regulator with enable function, the regulator delivers a guaranteed 600mA (min.) continuous load current. Features Output Voltage Accuracy: ±1.5% Output Current: 600mA (Min.) Foldback Short Current Protection: 50mA Enable Function to Turn ON/OFF VOUT Low Dropout Voltage (3.3V): 250mV (Typ.) @IOUT=600mA Excellent Load Regulation: 0.2%/A (Typ.) Excellent Line Regulation: 0.02%/V (Typ.) Low Quiescent Current: 55μA (Typ.) Low Standby Current: 0.01μA (Typ.) Low Output Noise: 50μVRMS PSRR: 100Hz -65dB, 1kHz -65dB OTSD Protection Stable with 1.0μF Flexible Cap: Ceramic, Tantalum and Aluminum Electrolytic Operation Temperature Range: -40°C to 85°C ESD: MM 400V, HBM 4000V; PROD_ID: VREG-12457
U4 = ALLEYBEACH_LIB:ATSAMD21J18
VIN = testpad:PTR1: TEST PIN
Y1 Y2 = SparkFun-FreqCtrl:RESONATOR: Resonator Small SMD resonator. Used, eg, on the Arduino Pro/ Pro Mini boards. 8MHz- XTAL-08895 16MHz- XTAL-08900; PROD_ID: XTAL-08900; VALUE: 16MHZ

## Net classes
1 USB: width 0.254 mm, drill 0.33 mm, clearance 0.159 mm
2 Top GND Pour: clearance 0.762 mm to class 1